# Altium schematic sheet [Altium] ir-rgb-controller-schematic.schdoc
size 163 x 140 mm
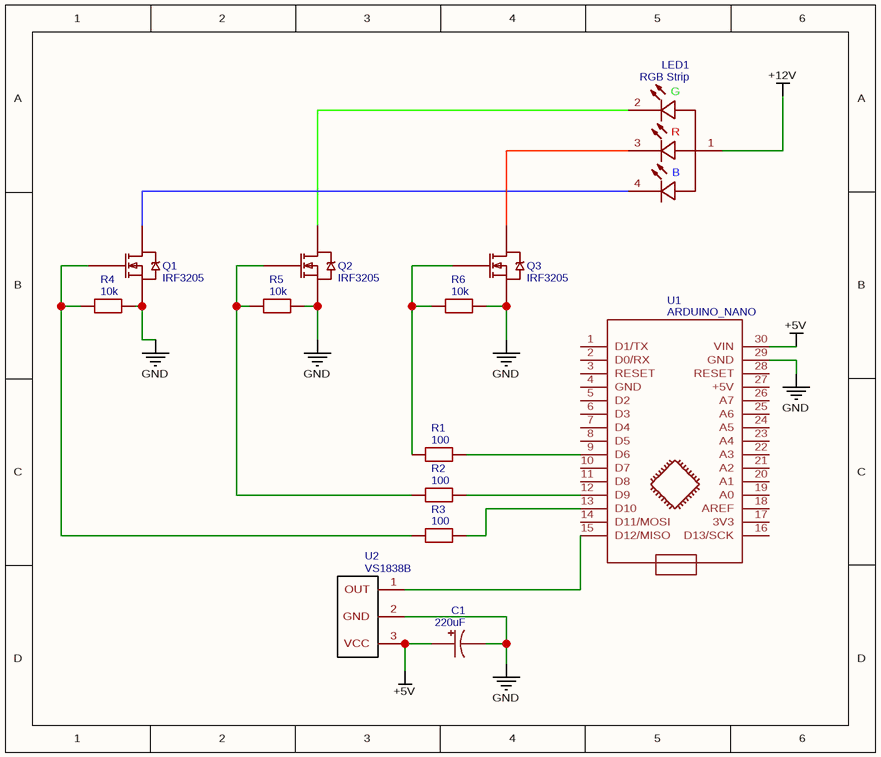
[diagram p0: [Altium] ir-rgb-controller-schematic.schdoc]

## Parts
C1  220uF  [CAP-TH_BD6.3-P2.50-D1.0-FD]
LED1  RGB Strip  [WJ2EDGVC-5.08-4P]
Q1  IRF3205  [TO-220AB]
Q2  IRF3205  [TO-220AB]
Q3  IRF3205  [TO-220AB]
R1  100  [R_AXIAL-0.4]
R2  100  [R_AXIAL-0.4]
R3  100  [R_AXIAL-0.4]
R4  10k  [R_AXIAL-0.4]
R5  10k  [R_AXIAL-0.4]
R6  10k  [R_AXIAL-0.4]
U1  ARDUINO_NANO  [ARDUINO_NANO]
U2  VS1838B  [VS1838B]

## Nets
+5V: C1.1 U1.30(VIN) U2.3(VCC)
+12V: LED1.1(CA)
GND: C1.2 Q1.3(S) Q2.3(S) Q3.3(S) R4.2 R5.2 R6.2 U1.29(GND) U2.2(GND)
NetLED1_2: LED1.2(KG) Q2.2(D)
NetLED1_3: LED1.3(KR) Q3.2(D)
NetLED1_4: LED1.4(KB) Q1.2(D)
NetQ1_1: Q1.1(G) R3.1 R4.1
NetQ2_1: Q2.1(G) R2.1 R5.1
NetQ3_1: Q3.1(G) R1.1 R6.1
NetR1_2: R1.2 U1.9(D6)
NetR2_2: R2.2 U1.12(D9)
NetR3_2: R3.2 U1.13(D10)
NetU1_15: U1.15(D12/MISO) U2.1(OUT)

Not connected (* = marked no-connect by the designer): U1 1(D1/TX) 2(D0/RX) 3(RESET) 4(GND) 5(D2) 6(D3) 7(D4) 8(D5) 10(D7) 11(D8) 14(D11/MOSI) 16(D13/SCK) 17(3V3) 18(AREF) 19(A0) 20(A1) 21(A2) 22(A3) 23(A4) 24(A5) 25(A6) 26(A7) 27(+5V) 28(RESET)

## Notes on the sheet
- (in symbol RGB Strip) G; R; B

## Library data of the parts
C1 = 220uF: BOM_Manufacturer: SamYoung Electronics; nameAlias: Capacitance; Contributor: LCSC; BOM_Supplier: LCSC; BOM_Supplier Part: C165659; BOM_Manufacturer Part: -; spicePre: C; spiceSymbolName: NHA 25V220uF
LED1 = RGB Strip: Contributor: LCSC; spicePre: L; spiceSymbolName: RGB Strip
Q1-Q3 = IRF3205: description: HEXFET Power MOSFET; spicePre: Q; spiceSymbolName: IRF3205
R1-R3 = 100: nameAlias: Value(Ω); Contributor: LCEDA_Lib; spicePre: R; spiceSymbolName: R_AXIAL-0.4_EU
R4-R6 = 10k: nameAlias: Value(Ω); Contributor: LCEDA_Lib; spicePre: R; spiceSymbolName: R_AXIAL-0.4_EU
U1 = ARDUINO_NANO: sourceId: KGSeAWhDB; timeStamp: 1452340004; spicePre: U; spiceSymbolName: ARDUINO_NANO
U2 = VS1838B: Contributor: franx411; BOM_Manufacturer Part: VS1838B; spicePre: U; spiceSymbolName: VS1838B